# EAGLE design Gas Sensor PCB (EAGLE 8.7.1)
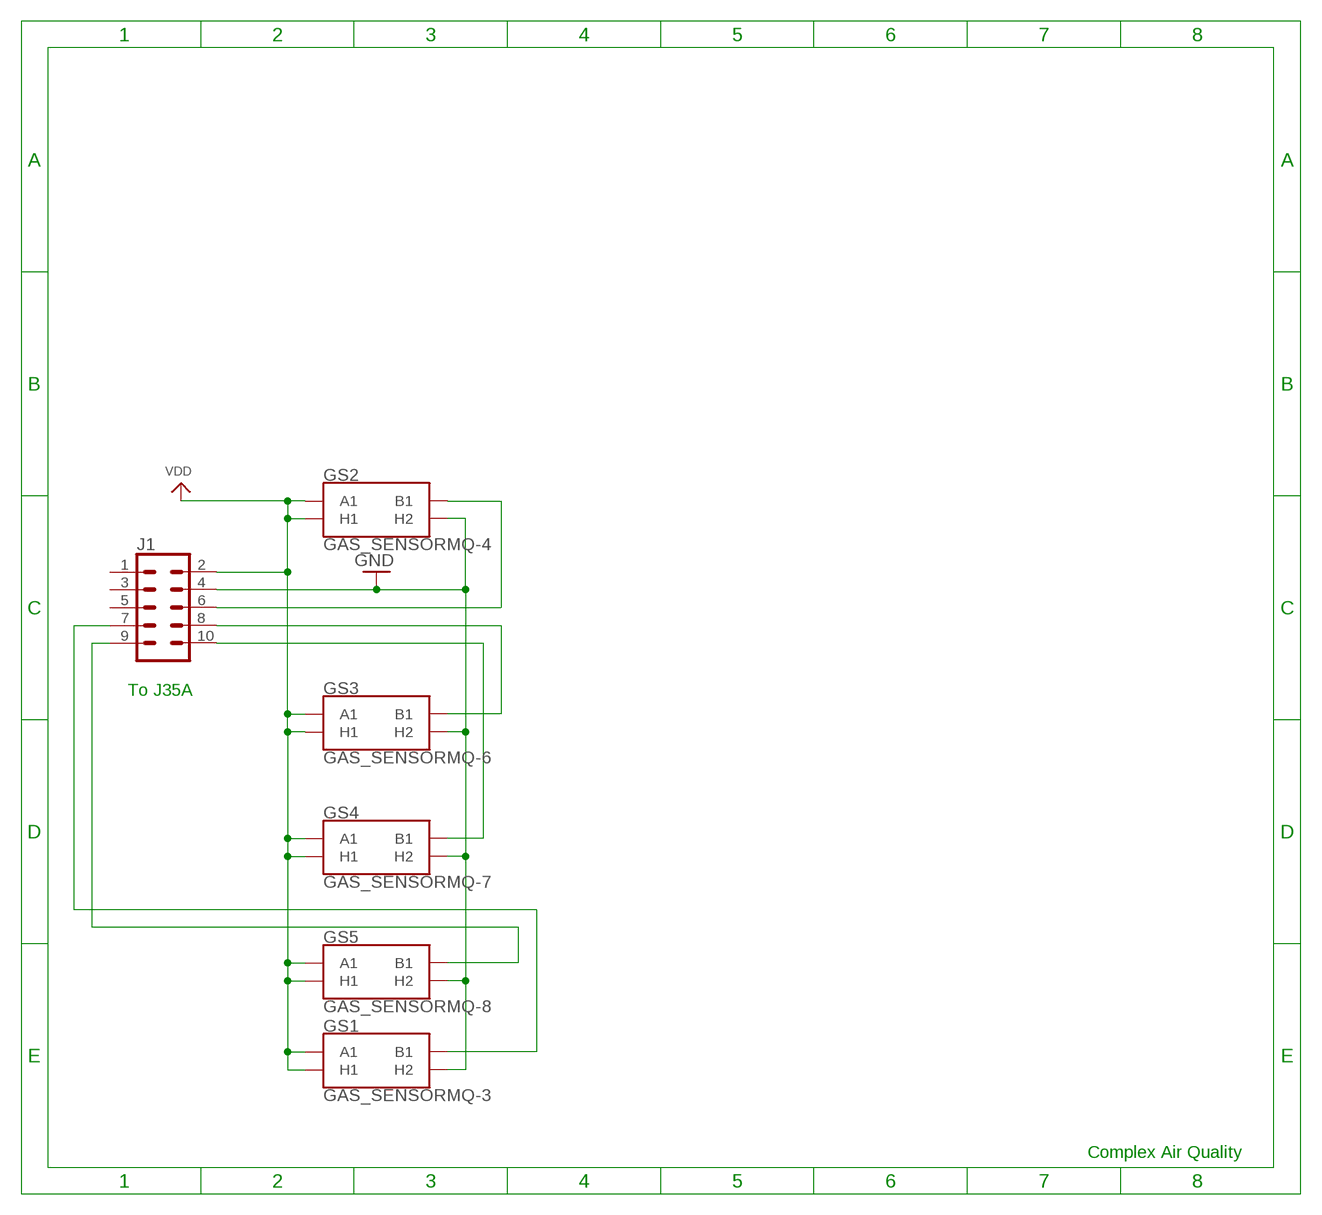
[diagram p0: schematic, sheet 1]

## Parts
GS1  GAS_SENSORMQ-3  [GAS_SENSOR]
GS2  GAS_SENSORMQ-4  [GAS_SENSOR]
GS3  GAS_SENSORMQ-6  [GAS_SENSOR]
GS4  GAS_SENSORMQ-7  [GAS_SENSOR]
GS5  GAS_SENSORMQ-8  [GAS_SENSOR]
J1  CONN_05X2SHD  [2X5-SHROUDED]

## Nets
GND: GS1.HB(H2) GS2.HB(H2) GS3.HB(H2) GS4.HB(H2) GS5.HB(H2) J1.4
N$1: GS1.B1 J1.7
N$65: GS2.B1 J1.6
N$67: GS3.B1 J1.8
N$68: GS4.B1 J1.10
N$69: GS5.B1 J1.9
VDD: GS1.A1 GS1.HA(H1) GS2.A1 GS2.HA(H1) GS3.A1 GS3.HA(H1) GS4.A1 GS4.HA(H1) GS5.A1 GS5.HA(H1) J1.2
Unconnected: J1.1 J1.3 J1.5

## Notes on the sheet
- To J35A
- Complex Air Quality

## Library data of the parts
GS1 = SparkFun-Sensors:GAS_SENSOR: Gas Sensors - MQ-3, MQ-4, MQ-6, MQ-7, MQ-8 Through-hole gas sensors with a heating coil and an analog output. Example Datasheet <https://cdn.sparkfun.com/datasheets/Sensors/Biometric/MQ-3%20ver1.3%20-%20Manual.pdf> SparkFun Products Gas Sensor Breakout Board <https://www.sparkfun.com/products/8891> (BOB-8891) - Breakout board compatible with all gas sensors. Alcohol Gas Sensor - MQ-3 <https://www.sparkfun.com/products/8880> (SEN-08880) Methane CNG Gas Sensor - MQ-4 <https://www.sparkfun.com/products/9404> (SEN-09404) LPG Gas Sensor - MQ-6 <https://www.sparkfun.com/products/9405> (SEN-09405) Carbon Monoxide Sensor - MQ-7 <https://www.sparkfun.com/products/9403> (SEN-09403) Hydrogen Gas Sensor - MQ-8 <https://www.sparkfun.com/products/10916> (SEN-10916); PROD_ID: COMP-12216; SF_ID: SEN-08880
GS2 = SparkFun-Sensors:GAS_SENSOR: Gas Sensors - MQ-3, MQ-4, MQ-6, MQ-7, MQ-8 Through-hole gas sensors with a heating coil and an analog output. Example Datasheet <https://cdn.sparkfun.com/datasheets/Sensors/Biometric/MQ-3%20ver1.3%20-%20Manual.pdf> SparkFun Products Gas Sensor Breakout Board <https://www.sparkfun.com/products/8891> (BOB-8891) - Breakout board compatible with all gas sensors. Alcohol Gas Sensor - MQ-3 <https://www.sparkfun.com/products/8880> (SEN-08880) Methane CNG Gas Sensor - MQ-4 <https://www.sparkfun.com/products/9404> (SEN-09404) LPG Gas Sensor - MQ-6 <https://www.sparkfun.com/products/9405> (SEN-09405) Carbon Monoxide Sensor - MQ-7 <https://www.sparkfun.com/products/9403> (SEN-09403) Hydrogen Gas Sensor - MQ-8 <https://www.sparkfun.com/products/10916> (SEN-10916); PROD_ID: COMP-11559; SF_ID: SEN-09404
GS3 = SparkFun-Sensors:GAS_SENSOR: Gas Sensors - MQ-3, MQ-4, MQ-6, MQ-7, MQ-8 Through-hole gas sensors with a heating coil and an analog output. Example Datasheet <https://cdn.sparkfun.com/datasheets/Sensors/Biometric/MQ-3%20ver1.3%20-%20Manual.pdf> SparkFun Products Gas Sensor Breakout Board <https://www.sparkfun.com/products/8891> (BOB-8891) - Breakout board compatible with all gas sensors. Alcohol Gas Sensor - MQ-3 <https://www.sparkfun.com/products/8880> (SEN-08880) Methane CNG Gas Sensor - MQ-4 <https://www.sparkfun.com/products/9404> (SEN-09404) LPG Gas Sensor - MQ-6 <https://www.sparkfun.com/products/9405> (SEN-09405) Carbon Monoxide Sensor - MQ-7 <https://www.sparkfun.com/products/9403> (SEN-09403) Hydrogen Gas Sensor - MQ-8 <https://www.sparkfun.com/products/10916> (SEN-10916); SF_ID: SEN-09405
GS4 = SparkFun-Sensors:GAS_SENSOR: Gas Sensors - MQ-3, MQ-4, MQ-6, MQ-7, MQ-8 Through-hole gas sensors with a heating coil and an analog output. Example Datasheet <https://cdn.sparkfun.com/datasheets/Sensors/Biometric/MQ-3%20ver1.3%20-%20Manual.pdf> SparkFun Products Gas Sensor Breakout Board <https://www.sparkfun.com/products/8891> (BOB-8891) - Breakout board compatible with all gas sensors. Alcohol Gas Sensor - MQ-3 <https://www.sparkfun.com/products/8880> (SEN-08880) Methane CNG Gas Sensor - MQ-4 <https://www.sparkfun.com/products/9404> (SEN-09404) LPG Gas Sensor - MQ-6 <https://www.sparkfun.com/products/9405> (SEN-09405) Carbon Monoxide Sensor - MQ-7 <https://www.sparkfun.com/products/9403> (SEN-09403) Hydrogen Gas Sensor - MQ-8 <https://www.sparkfun.com/products/10916> (SEN-10916); PROD_ID: COMP-12214; SF_ID: SEN-09403
GS5 = SparkFun-Sensors:GAS_SENSOR: Gas Sensors - MQ-3, MQ-4, MQ-6, MQ-7, MQ-8 Through-hole gas sensors with a heating coil and an analog output. Example Datasheet <https://cdn.sparkfun.com/datasheets/Sensors/Biometric/MQ-3%20ver1.3%20-%20Manual.pdf> SparkFun Products Gas Sensor Breakout Board <https://www.sparkfun.com/products/8891> (BOB-8891) - Breakout board compatible with all gas sensors. Alcohol Gas Sensor - MQ-3 <https://www.sparkfun.com/products/8880> (SEN-08880) Methane CNG Gas Sensor - MQ-4 <https://www.sparkfun.com/products/9404> (SEN-09404) LPG Gas Sensor - MQ-6 <https://www.sparkfun.com/products/9405> (SEN-09405) Carbon Monoxide Sensor - MQ-7 <https://www.sparkfun.com/products/9403> (SEN-09403) Hydrogen Gas Sensor - MQ-8 <https://www.sparkfun.com/products/10916> (SEN-10916); PROD_ID: COMP-13351; SF_ID: SEN-10916
J1 = SparkFun-Connectors:CONN_05X2: Multi connection point. Often used as Generic Header-pin footprint for 0.1 inch spaced/style header connections For AVR SPI programming port, see special device with nice symbol: "AVR_SPI_PROG_5x2.dev" You can populate with any combo of single row headers, but if you'd like an exact match, check these: 2x5 AVR ICSP Male Header <https://www.sparkfun.com/products/778> (PRT-00778) 2x5 Pin Shrouded Header <https://www.sparkfun.com/products/8506> (PRT-08506) On any of the 0.1 inch spaced packages, you can populate with these: Break Away Headers - Straight <https://www.sparkfun.com/products/116> (PRT-00116) Break Away Male Headers - Right Angle <https://www.sparkfun.com/products/553> (PRT-00553) Female Headers <https://www.sparkfun.com/products/115> (PRT-00115) Break Away Headers - Machine Pin <https://www.sparkfun.com/products/117> (PRT-00117) Break Away Female Headers - Swiss Machine Pin <https://www.sparkfun.com/products/743> (PRT-00743) Special note: the shrouded connector mates well with our 5x2 ribbon cables: 2x5 Pin IDC Ribbon Cable <https://www.sparkfun.com/products/8535> (PRT-08535); PROD_ID: CONN-08671; SF_ID: PRT-08506

## Board
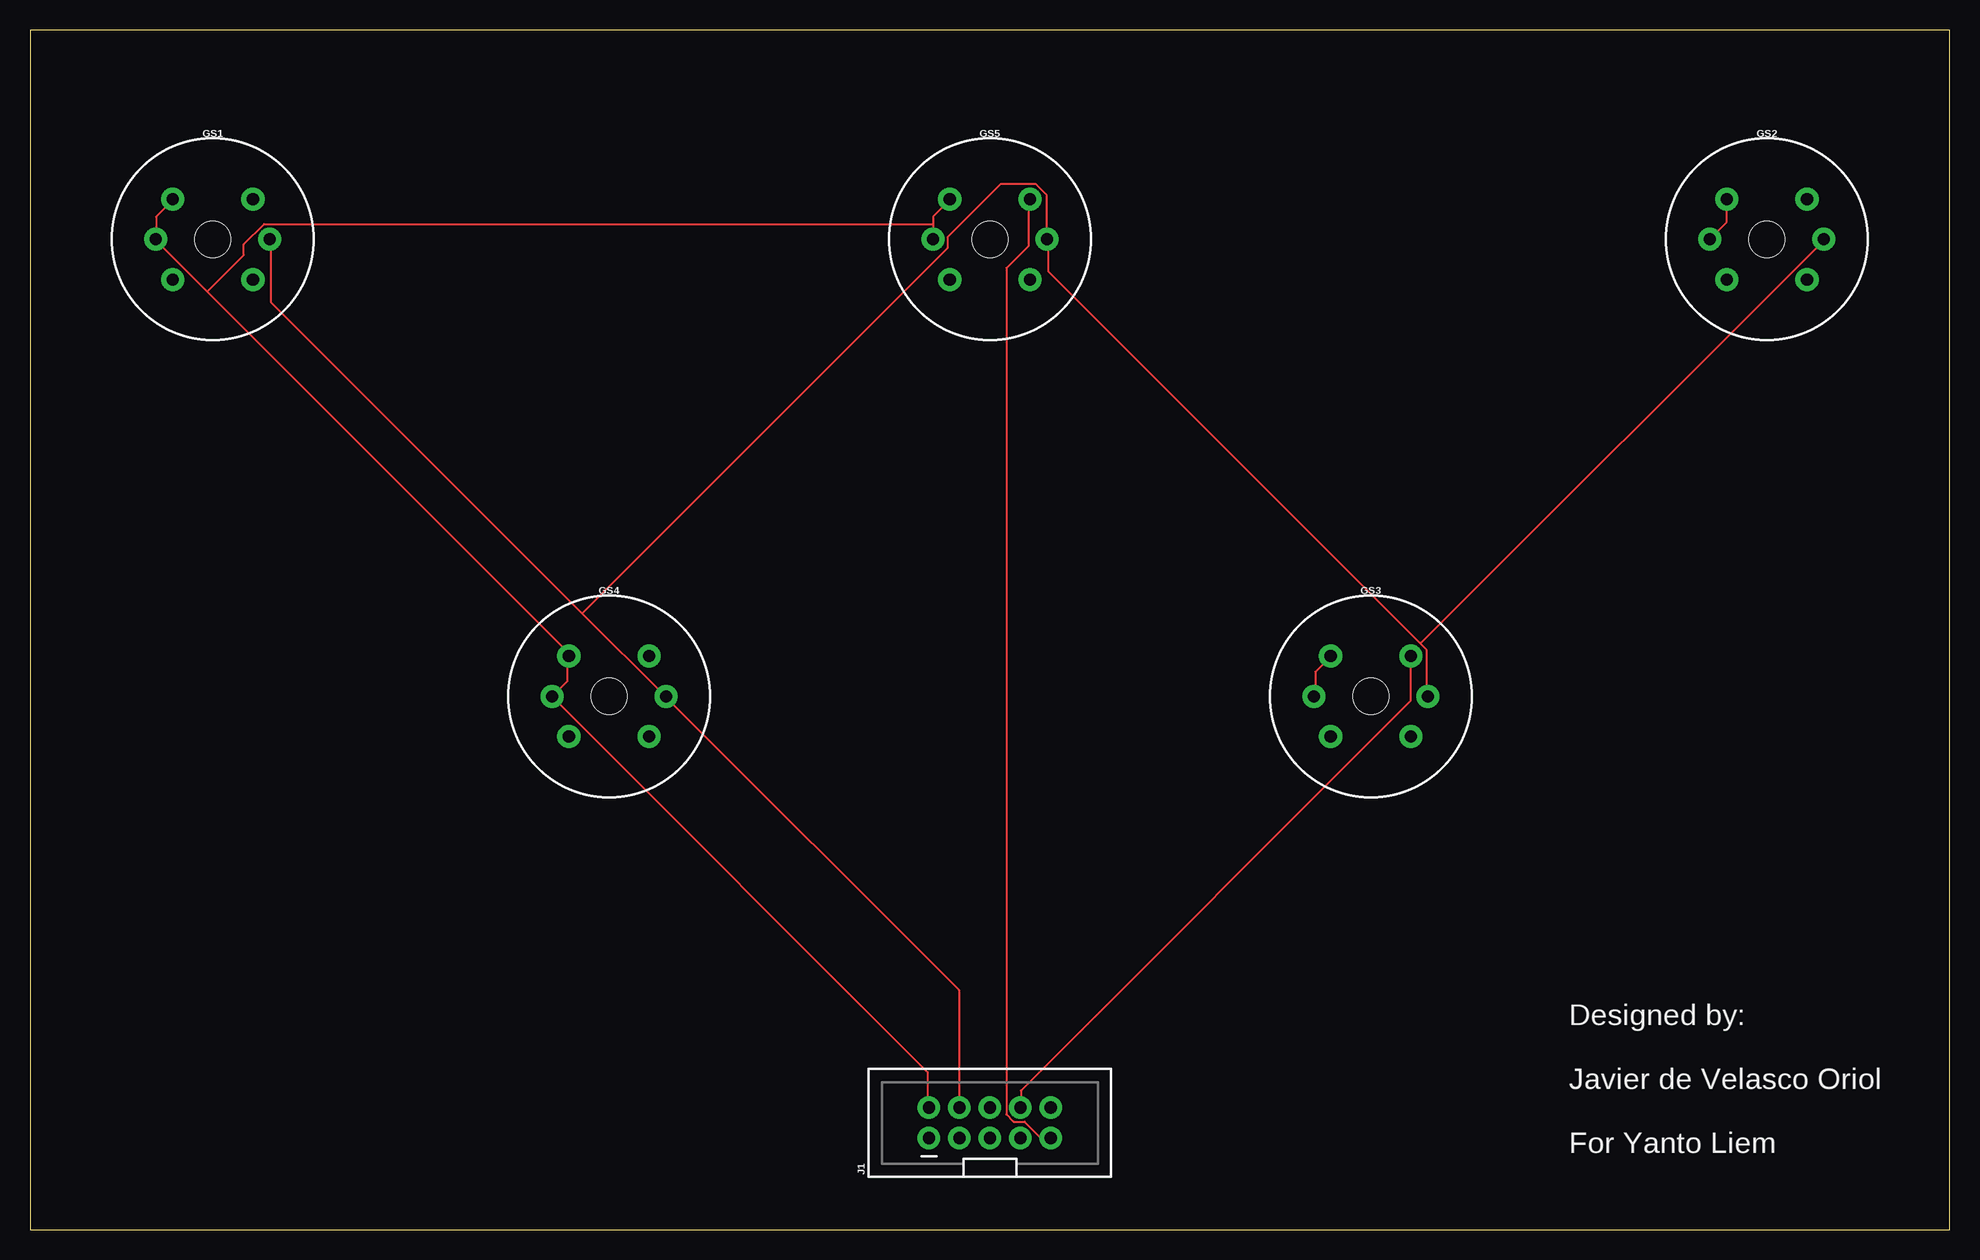
[diagram p1: board, top side]
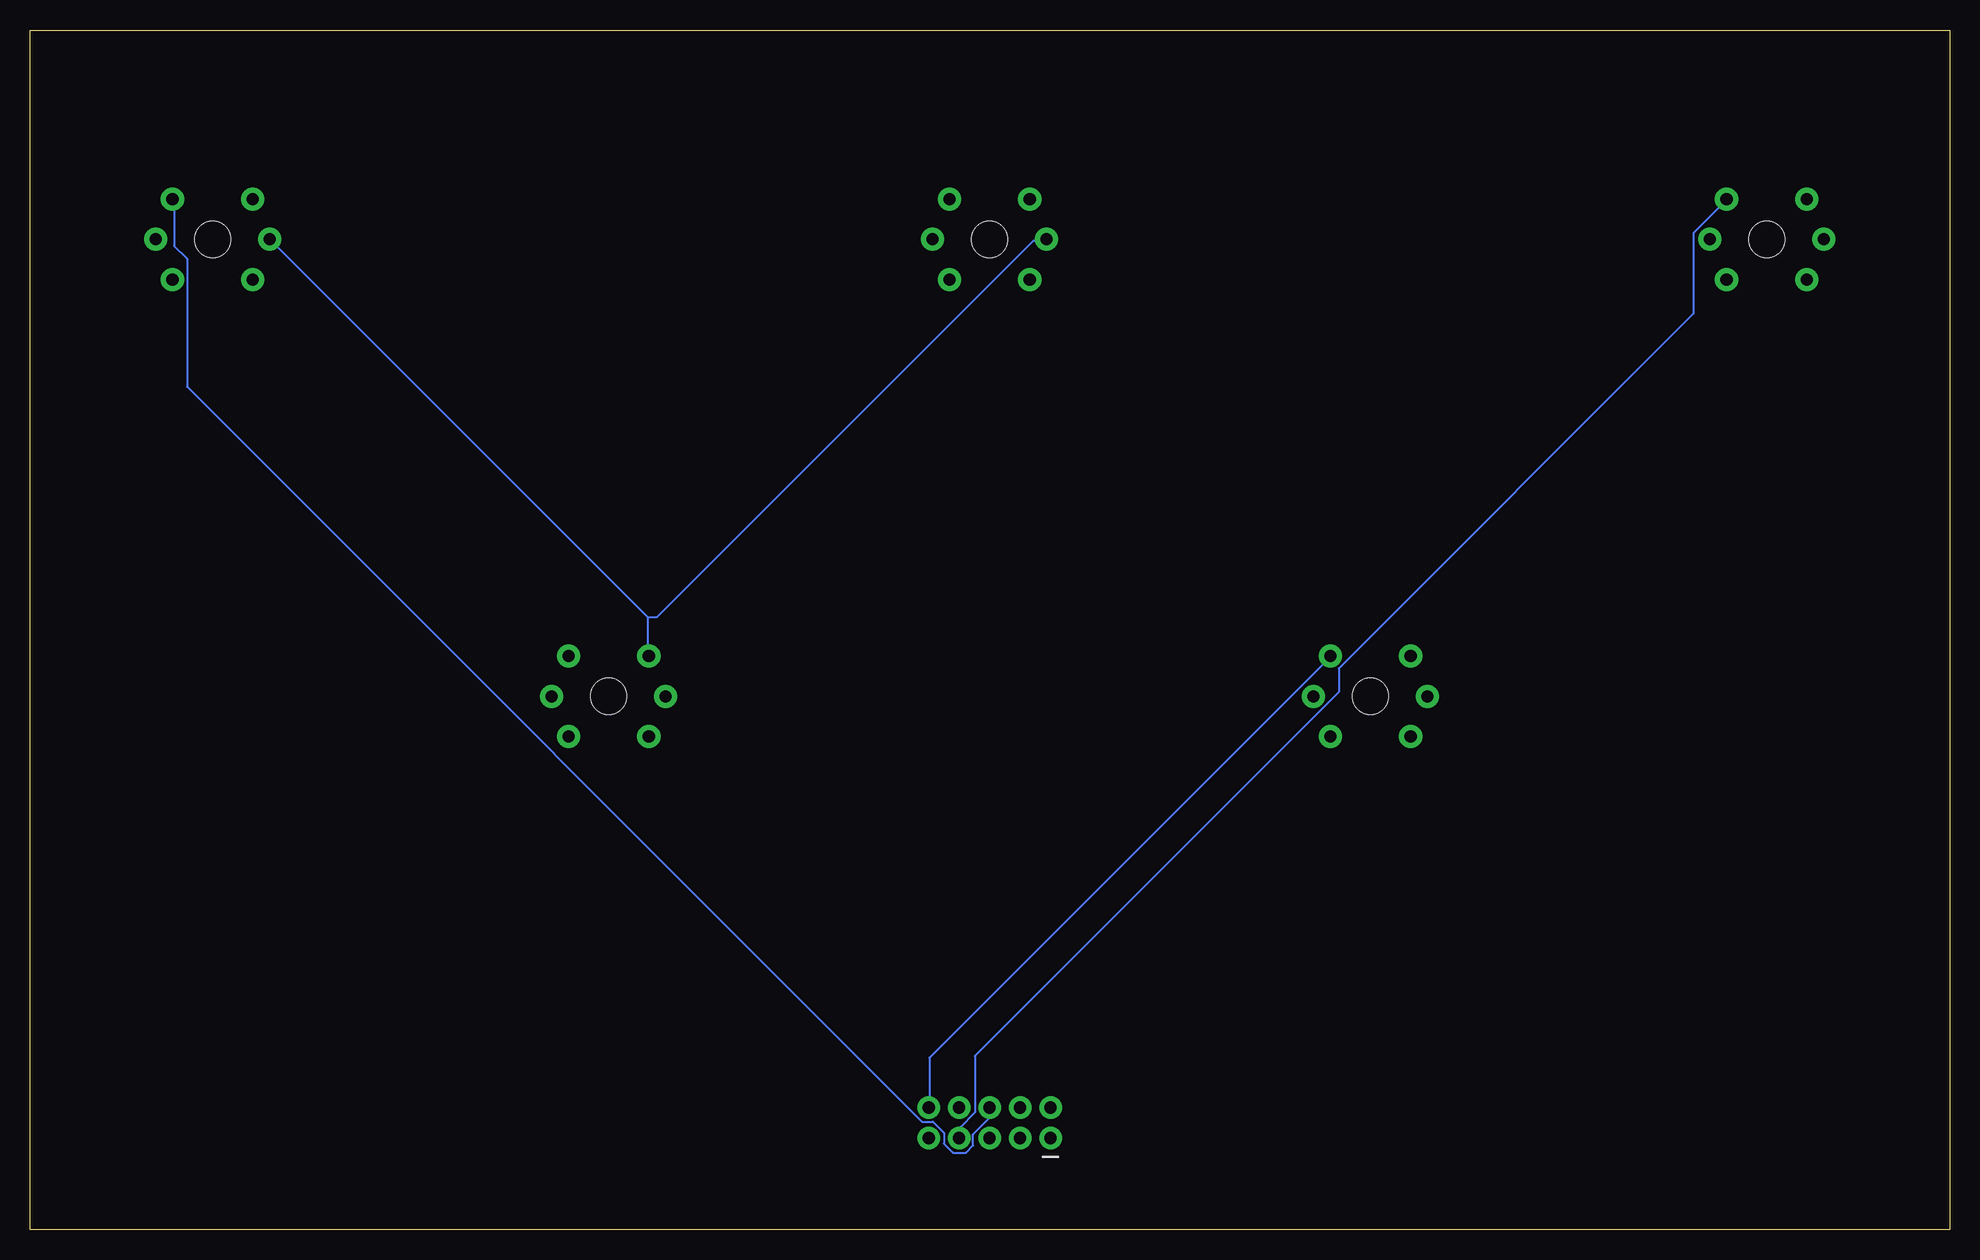
[diagram p2: board, bottom side, seen from below]

Size 160 x 100 mm. Coordinates in mm from the lower left corner, seen from the top.
Outline: 0,0 160,0 160,100 0,100 0,0
Copper layers (1*16): Top 0.035mm / dielectric 1.5mm / Bottom 0.035mm
Design rules "default": minimum track width 6mil, minimum drill 0.35mm, track to track 6mil, track to pad 6mil, pad to pad 6mil, via to via 6mil, smd to smd 6mil, copper to edge 40mil, drill to drill 6mil, minimum pad ring 10mil, minimum via ring 8mil, stop-mask expansion 4mil, vias tented up to drill 0mil, thermal gap 10mil

### Footprints (pad centres in the part's own frame; a part is rotated, then mirrored left to right if it is on the bottom)
GAS_SENSOR = drill 1.016 pad 1.93: A1 -3.35,3.35; A2 -3.35,-3.35; B1 3.35,3.35; B2 3.35,-3.35; HA -4.75,0; HB 4.75,0 | hole 3: 0,0
2X5-SHROUDED = drill 1.016 pad 1.88: 1 -1.27,5.08; 2 1.27,5.08; 3 -1.27,2.54; 4 1.27,2.54; 5 -1.27,0; 6 1.27,0; 7 -1.27,-2.54; 8 1.27,-2.54; 9 -1.27,-5.08; 10 1.27,-5.08

### Placement (x,y rotation side)
GS1  15.24,82.55 0 top
GS2  144.78,82.55 0 top
GS3  111.76,44.45 0 top
GS4  48.26,44.45 0 top
GS5  80.01,82.55 0 top
J1  80.01,8.89 90 top

### Tracks (layer width: path | path; a pad name or v marks a point on that pad's centre or on a via)
GND
  Top 0.152: 115.82,48.92 116.43,48.31 116.43,44.5 GS3.HB | 115.82,48.92 84.89,79.86 84.89,82.45 GS5.HB 84.73,82.6 84.73,86.26 83.82,87.17 80.92,87.17 76.5,82.75 76.5,81.84 46.02,51.36 | 115.82,48.92 115.98,48.92 149.5,82.45 GS2.HB | J1.4 77.42,10.21 77.42,19.96 53.03,44.35 GS4.HB 52.88,44.5 46.02,51.36 | 46.02,51.36 20.12,77.27 20.12,82.45 GS1.HB
N$1
  Bottom 0.152: J1.7 82.45,7.62 82.45,8.53 81.23,9.75 81.23,14.48 50.9,44.81 50.9,46.79 21.34,76.35 21.34,83.06 18.59,85.8 GS1.B1
N$65
  Bottom 0.152: J1.6 80.01,9.3 81.38,7.92 81.38,7.01 81.99,6.4 83.06,6.4 83.82,7.16 83.82,8.08 84.73,8.99 85.65,8.99 146.91,70.26 146.91,80.92 147.98,81.99 147.98,85.8 GS2.B1
N$67
  Top 0.152: J1.8 82.6,10.21 82.6,11.58 115.06,44.04 115.06,47.7 GS3.B1
N$68
  Bottom 0.152: J1.10 85.04,10.21 85.04,14.33 51.66,47.7 GS4.B1
N$69
  Top 0.152: J1.9 84.28,7.62 82.91,8.99 81.99,8.99 81.38,9.6 81.38,80.16 83.21,81.99 83.21,85.8 GS5.B1
VDD
  Top 0.152: 108.31,47.7 GS3.A1 108.36,47.7 107.14,46.48 107.14,44.5 GS3.HA 107.09,44.5 | 75.29,83.82 75.29,84.43 76.66,85.8 GS5.A1 | 75.29,83.82 75.29,82.6 GS5.HA | GS2.A1 141.43,85.8 141.43,83.97 140.06,82.6 GS2.HA | GS1.A1 11.89,85.8 10.52,84.43 10.52,82.6 GS1.HA 10.52,82.45 14.78,78.18 | J1.2 74.83,10.21 74.83,13.11 43.59,44.35 GS4.HA 43.59,44.5 44.81,45.72 44.81,47.7 GS4.A1 44.81,47.85 44.81,48.16 14.78,78.18 | 75.29,83.82 19.51,83.82 17.83,82.14 17.83,81.23 14.78,78.18
  Bottom 0.152: 108.51,51.05 108.51,47.85 GS3.A1 | 108.51,51.05 139.9,82.45 GS2.HA | 108.51,51.05 107.75,51.05 76.35,82.45 75.29,82.45 GS5.HA

### Text on the board
tNames: Designed by: / / Javier de Velasco Oriol / / For Yanto Liem